# EAGLE design mains_relay (EAGLE 7.5.0)
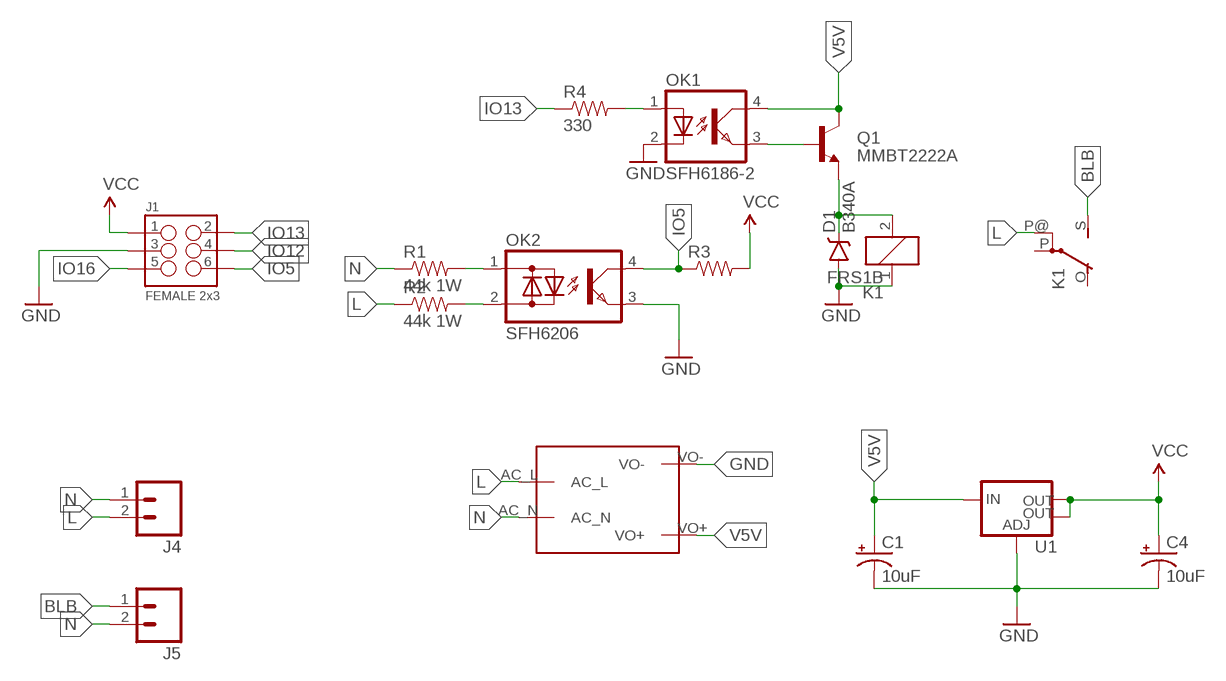
[diagram p0: schematic, sheet 1]

## Parts
C1  10uF  CAP_POL1206-KIT  [EIA3216-KIT]
C4  10uF  CAP_POL1206-KIT  [EIA3216-KIT]
D1  B340A  DIODE-SCHOTTKY-B340A  [SMA-DIODE]
J1  FEMALE 2x3  M03X2SHROUD  [2X3-SHROUDED]
J4  M025MM  [SCREWTERMINAL-5MM-2]
J5  M025MM  [SCREWTERMINAL-5MM-2]
K1  FRS1B  [FRS1B]
OK1  SFH6186-2  [SMD4]
OK2  SFH6206  [DIL4-SMD]
Q1  MMBT2222A  TRANSISTOR_NPNMMBT2222A  [SOT23-3]
R1  44k 1W  RESISTORPTH-1/4W  [AXIAL-0.4]
R2  44k 1W  RESISTORPTH-1/4W  [AXIAL-0.4]
R3  RESISTOR0805-RES  [0805]
R4  330  RESISTOR0805-RES  [0805]
U1  V_REG_LM1117SOT223  [SOT223]
U$1  MAINS_CONVERTERS  [HLK-PM01]

## Nets
BLB: J5.1 K1.S(2:S)
GND: C1.C(-) C4.C(-) D1.A J1.3 K1.1 OK1.2(C) OK2.3(E) U1.1(ADJ) U$1.VO-
IO5: J1.6 OK2.4(C) R3.1
IO12: J1.4
IO13: J1.2 R4.1
IO16: J1.5
L: J4.2 K1.P@(2:P) R2.P$1 U$1.AC_L
N: J4.1 J5.2 R1.P$1 U$1.AC_N
N$1: OK2.1(AC1) R1.P$2
N$2: OK2.2(AC2) R2.P$2
N$3: OK1.1(A) R4.2
N$4: D1.C K1.2 Q1.2(E)
N$8: OK1.3(EMIT) Q1.1(B)
V5V: C1.A(+) OK1.4(COL) Q1.3(C) U1.3(IN) U$1.VO+
VCC: C4.A(+) J1.1 R3.2 U1.2(OUT) U1.4(OUT)
Unconnected: K1.O(2:O) K1.P(2:P)

## Library data of the parts
C1 C4 = SparkFun-Capacitors:CAP_POL: Capacitor Polarized These are standard SMD and PTH capacitors. Normally 10uF, 47uF, and 100uF in electrolytic and tantalum varieties. Always verify the external diameter of the through hole cap, it varies with capacity, voltage, and manufacturer. The EIA devices should be standard.
D1 = SparkFun-DiscreteSemi:DIODE-SCHOTTKY: Schottky diodes in SFE's production catalog BAT20J 1A 23V 0.62Vf RB751 120mA 40V 0.37Vf PMEG4005EJ 0.5A 40V 0.42Vf MBRA140 1A 40V 0.5Vf B340A 3A 40V SMA; PROD_ID: DIO-09886
J1 = SparkFun-Connectors:M03X2: 2x3 .1" header. Shrouded, with keying- CONN-10681 SMT- CONN-11415 Pogo pins- HW-11044; PROD_ID: CONN-10681
J4 J5 = SparkFun-Connectors:M02: Standard 2-pin 0.1" header. Use with - straight break away headers ( PRT-00116) - right angle break away headers (PRT-00553) - swiss pins (PRT-00743) - machine pins (PRT-00117) - female headers (PRT-00115) Molex polarized connector foot print use with: PRT-08233 with associated crimp pins and housings. 2.54_SCREWTERM for use with PRT-10571. 3.5mm Screw Terminal footprints for PRT-08084 5mm Screw Terminal footprints for use with PRT-08432; STOREFRONT_ID: PRT-08432
K1 = relay:FRS1B: RELAY 1 x switch, same as V23101-D6-A201, Siemens; OC_FARNELL: unknown; OC_NEWARK: unknown
OK1 = optodevices:SFH618?*: Optocoupler, Phototransistor Output, Low Input Current Source: http://www.vishay.com/docs/83673/sfh618.pdf
OK2 = optodevices:SFH620: Optocoupler, Phototransistor Output, AC Input Source: http://www.vishay.com/docs/83675/sfh620.pdf
Q1 = SparkFun-DiscreteSemi:TRANSISTOR_NPN: Generic NPN BJT MMBT2222A - TRANS-08049 (SOT-23, 1A 40V) MPSA42 - TRANS-09116 (SOT-23, 500mA 300V) MMBT5088LT1G - TRANS-11160 (SOT-23, 50 mA 30V) BC547 - COM-08928 <http://www.sparkfun.com/products/8928> (TO-92 45V 100mA) (1.Collector 2.Base 3.Emitter) 2N3904 - COM-00521 <http://www.sparkfun.com/products/521> (TO-92 40V 200mA) (1.Emitter 2.Base 3.Collector) P2N2222A - COM-12852 <http://www.sparkfun.com/products/12852> (TO-92 40V 600mA) (1.Collector 2.Base 3.Emitter); PROD_ID: TRANS-08049
R1 R2 = SparkFun-Resistors:RESISTOR: Resistor Basic schematic elements and footprints for 0603, 1206, and PTH resistors.
R3 R4 = SparkFun-Passives:RESISTOR: Resistor Basic schematic elements and footprints for 0603, 1206, and PTH resistors.
U1 = SparkFun-PowerIC:V_REG_LM1117: Voltage Regulator LM1117 Standard adjustable voltage regulator but in SMD form. Spark Fun Electronics SKU : COM-00595; PROD_ID: VREG-08170
U$1 = captain-slow:MAINS_CONVERTERS

## Board
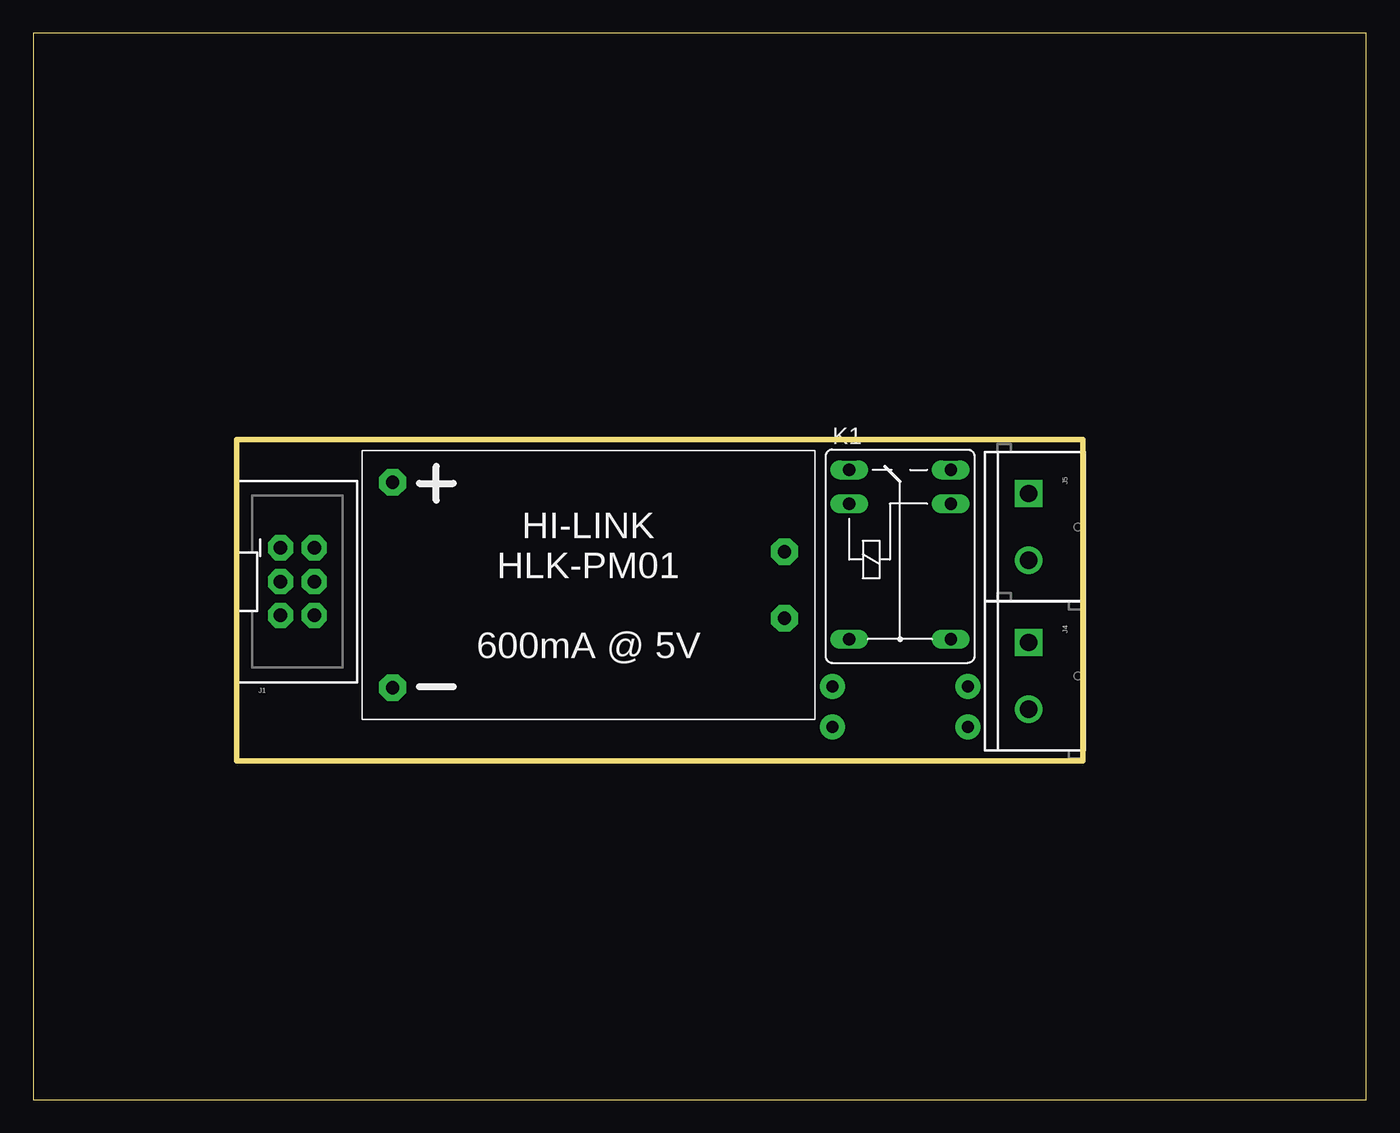
[diagram p1: board, top side]
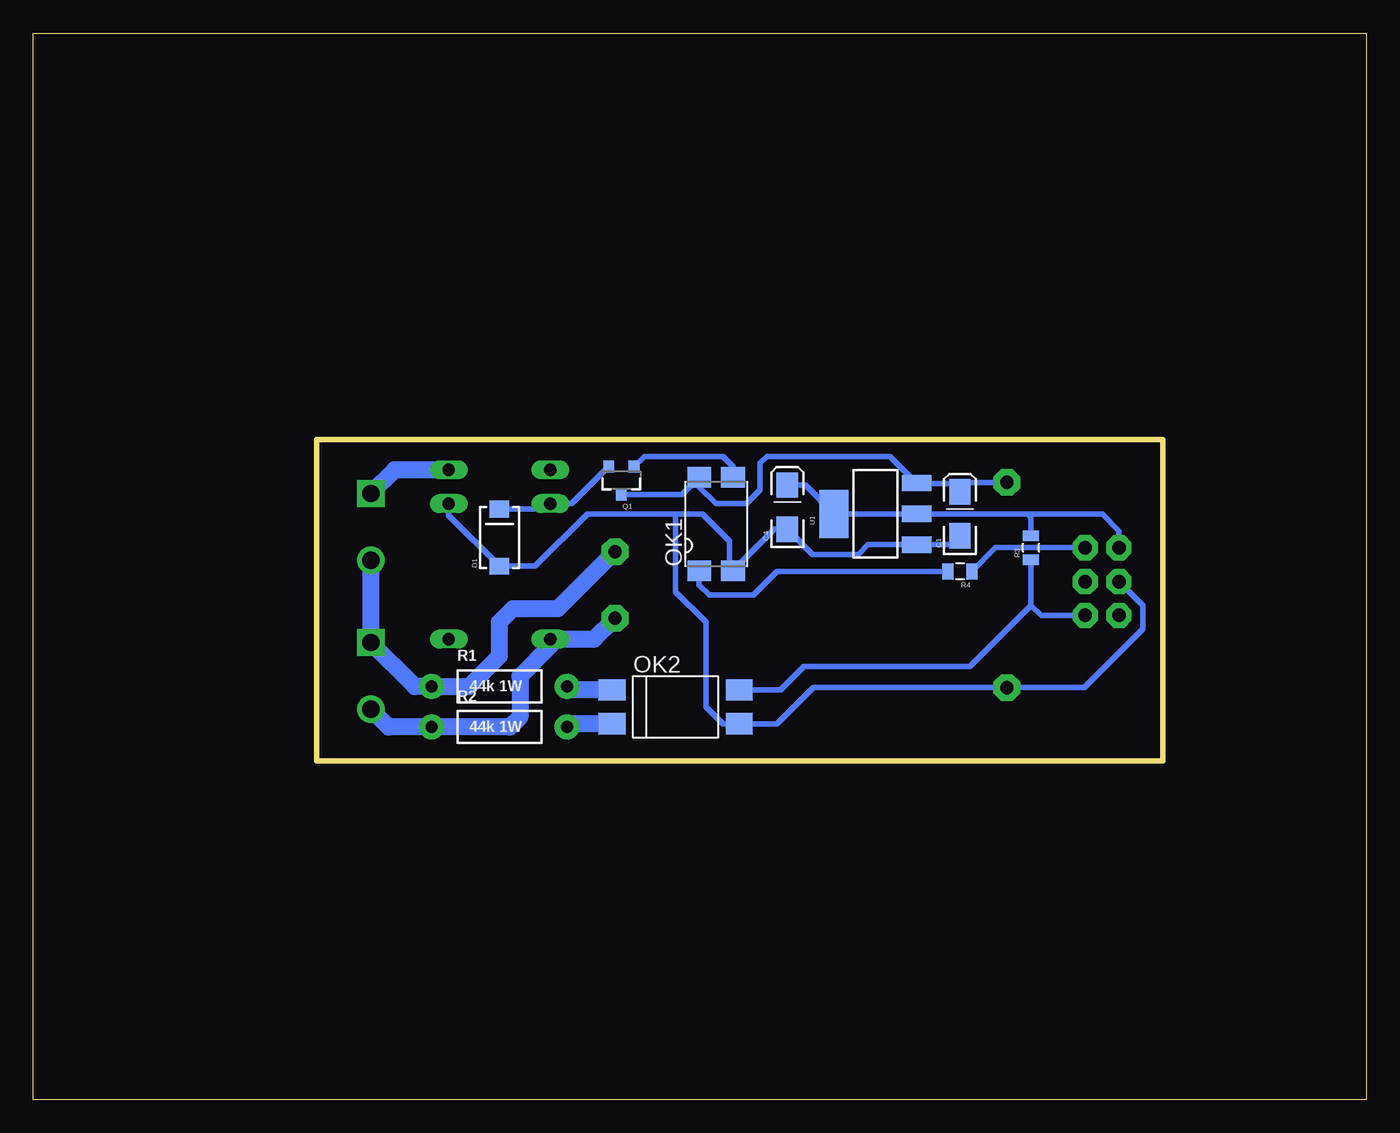
[diagram p2: board, bottom side, seen from below]

Size 100 x 80 mm. Coordinates in mm from the lower left corner, seen from the top.
Outline: 0,0 100,0 100,80 0,80 0,0
Outline: 78.74,49.53 78.74,25.4 15.24,25.4 15.24,49.53 78.74,49.53
Copper layers (1*16): Top 0.035mm / dielectric 1.5mm / Bottom 0.035mm
Design rules "default": minimum track width 10mil, minimum drill 24mil, track to track 8mil, track to pad 8mil, pad to pad 8mil, via to via 8mil, smd to smd 8mil, copper to edge 40mil, drill to drill 8mil, minimum pad ring 10mil, minimum via ring 8mil, stop-mask expansion 4mil, vias tented up to drill 0mil, thermal gap 10mil

### Footprints (pad centres in the part's own frame; a part is rotated, then mirrored left to right if it is on the bottom)
EIA3216-KIT = smd 1.9 x 1.6: A 1.65,0; C -1.65,0
SMA-DIODE = smd 1.27 x 1.47: A -2.15,0; C 2.15,0
2X3-SHROUDED = drill 1.016 pad 1.88 octagon: 1 -1.27,2.54; 2 1.27,2.54; 3 -1.27,0; 4 1.27,0; 5 -1.27,-2.54; 6 1.27,-2.54
SCREWTERMINAL-5MM-2 = drill 1.3 pad 2.032 square: 1 0,0 | drill 1.3 pad 2.032: 2 5,0
FRS1B = drill 0.914 long: 1 0,3.81; 2 0,-3.81; O -2.54,-3.81; P 10.16,3.81; P@ 10.16,-3.81; S -2.54,3.81
SMD4 = smd 1.78 x 1.55: 1 -1.27,-3.5; 2 1.27,-3.5; 3 1.27,3.5; 4 -1.27,3.5
DIL4-SMD = smd 1.6 x 2: 1 -1.27,-4.77; 2 1.27,-4.77; 3 1.27,4.77; 4 -1.27,4.77
SOT23-3 = smd 0.8 x 0.9: 1 -0.95,-1; 2 0.95,-1; 3 0,1.1
AXIAL-0.4 = drill 0.9 pad 1.88: P$1 -5.08,0; P$2 5.08,0
0805 = smd 0.8 x 1.2: 1 -0.9,0; 2 0.9,0
SOT223 = smd 1.219 x 2.235: 1 -2.311,-3.099; 2 0,-3.099; 3 2.311,-3.099 | smd 3.6 x 2.2: 4 0,3.099
HLK-PM01 = drill 1 pad 2 octagon: AC_L -14.7,2.5; AC_N -14.7,-2.5; VO+ 14.7,-7.7; VO- 14.7,7.7

### Placement (x,y rotation side)
C1  30.48,43.94 90 bottom
C4  43.43,44.45 90 bottom
D1  65.02,42.16 90 bottom
J1  19.81,38.86 0 top
J4  74.68,34.29 270 top
J5  74.68,45.47 270 top
K1  65.02,44.7 270 top
OK1  48.77,43.18 0 bottom
OK2  51.82,29.46 270 bottom
Q1  55.88,46.48 180 bottom
R1  65.02,30.99 0 bottom
R2  65.02,27.94 0 bottom
R3  25.15,41.4 90 bottom
R4  30.48,39.62 180 bottom
U1  36.83,43.94 90 bottom
U$1  41.66,38.61 180 top

### Tracks (layer width: path | path; a pad name or v marks a point on that pad's centre or on a via)
BLB
  Bottom 1.27: K1.S 72.9,47.24 J5.1
GND
  Bottom 0.406: C1.C 31.14,41.63 U1.1 37.36,41.63 38.1,40.89 41.53,40.89 C4.C 44.38,42.8 OK1.2 47.75,39.93 47.75,41.91 49.78,43.94 51.82,43.94 | J1.3 16.76,37.08 16.76,35.31 21.16,30.91 U$1.VO- 26.98,30.93 41.46,30.93 44.2,28.19 OK2.3 48.26,28.19 49.53,29.46 49.53,35.81 51.82,38.1 51.82,43.94 | K1.1 68.83,43.82 D1.A 62.35,40.01 58.42,43.94 51.82,43.94
IO5
  Bottom 0.406: OK2.4 43.94,30.73 42.16,32.51 29.72,32.51 25.15,37.08 | 25.15,37.08 R3.1 | J1.6 24.38,36.32 25.15,37.08
IO13
  Bottom 0.406: J1.2 27.8,41.4 R4.1
L
  Bottom 1.27: J4.2 73.33,27.94 R2.P$1 64.26,27.94 63.5,28.7 63.5,31.75 61.21,34.04 K1.P@ 57.92,34.54 U$1.AC_L
N
  Bottom 1.27: J5.2 J4.1 71.37,30.99 R1.P$1 67.31,30.99 65.02,33.27 65.02,35.81 64.01,36.83 60.63,36.83 U$1.AC_N
N$1
  Bottom 1.27: OK2.1 59.69,30.73 R1.P$2
N$2
  Bottom 1.27: OK2.2 59.69,28.19 R2.P$2
N$3
  Bottom 0.406: R4.2 44.2,39.62 45.97,37.85 49.28,37.85 50.04,38.61 OK1.1
N$4
  Bottom 0.406: Q1.2 59.61,44.7 K1.2 61.6,44.31 D1.C
N$8
  Bottom 0.406: OK1.3 47.5,47.5 48.26,48.26 54.15,48.26 Q1.1
V5V
  Bottom 0.406: U$1.VO+ 29.76,46.31 C1.A 31.12,46.23 33.45,46.23 U1.3 35.74,48.26 44.96,48.26 45.47,47.75 45.47,45.72 46.48,44.7 48.77,44.7 50.04,45.97 OK1.4 51.34,45.38 Q1.3
VCC
  Bottom 0.406: C4.A 42.09,46.1 U1.4 U1.2 25.4,43.94 | 25.4,43.94 19.81,43.94 18.54,42.67 J1.1 | R3.2 25.15,43.69 25.4,43.94